# EAGLE design optic PCB (EAGLE 9.1.3)
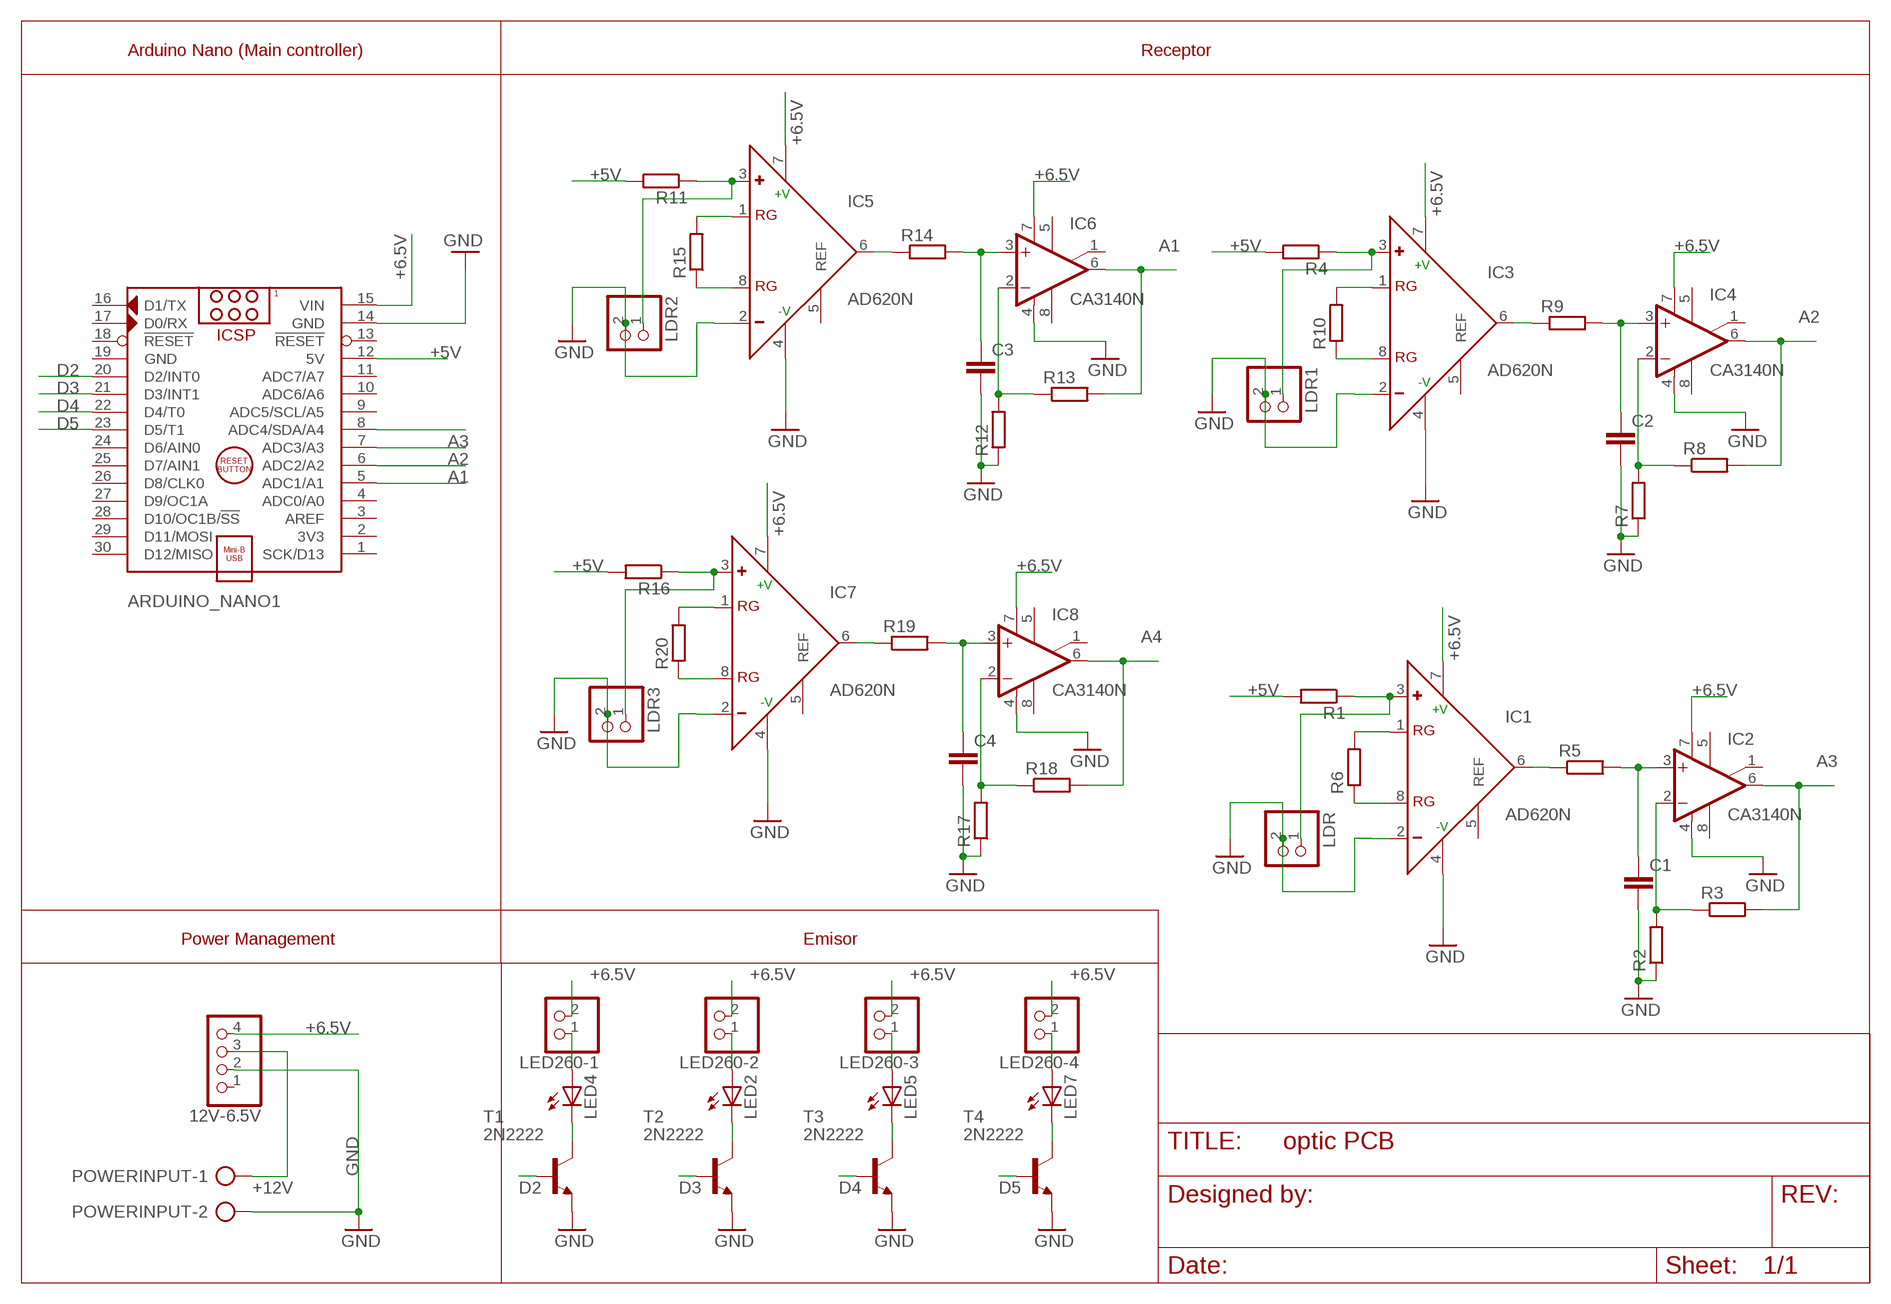
[diagram p0: schematic, sheet 1]

## Parts
12V-6.5V  PINHD-1X4  [1X04]
ARDUINO_NANO1  ARDUINO_NANO  [ARDUINO_NANO]
C1  C2.5/2  [C2.5-2]
C2  C2.5/2  [C2.5-2]
C3  C2.5/2  [C2.5-2]
C4  C2.5/2  [C2.5-2]
IC1  AD620N  [DIL08]
IC2  CA3140N  [DIL08]
IC3  AD620N  [DIL08]
IC4  CA3140N  [DIL08]
IC5  AD620N  [DIL08]
IC6  CA3140N  [DIL08]
IC7  AD620N  [DIL08]
IC8  CA3140N  [DIL08]
LDR  PINHD-1X2  [1X02]
LDR1  PINHD-1X2  [1X02]
LDR2  PINHD-1X2  [1X02]
LDR3  PINHD-1X2  [1X02]
LED2  LED5MM  [LED5MM]
LED4  LED5MM  [LED5MM]
LED5  LED5MM  [LED5MM]
LED7  LED5MM  [LED5MM]
LED260-1  PINHD-1X2  [1X02]
LED260-2  PINHD-1X2  [1X02]
LED260-3  PINHD-1X2  [1X02]
LED260-4  PINHD-1X2  [1X02]
POWERINPUT  AK500/2  [AK500/2]
R1  R-EU_0204/5  [0204/5]
R2  R-EU_0204/5  [0204/5]
R3  R-EU_0204/5  [0204/5]
R4  R-EU_0204/5  [0204/5]
R5  R-EU_0204/5  [0204/5]
R6  R-EU_0204/5  [0204/5]
R7  R-EU_0204/5  [0204/5]
R8  R-EU_0204/5  [0204/5]
R9  R-EU_0204/5  [0204/5]
R10  R-EU_0204/5  [0204/5]
R11  R-EU_0204/5  [0204/5]
R12  R-EU_0204/5  [0204/5]
R13  R-EU_0204/5  [0204/5]
R14  R-EU_0204/5  [0204/5]
R15  R-EU_0204/5  [0204/5]
R16  R-EU_0204/5  [0204/5]
R17  R-EU_0204/5  [0204/5]
R18  R-EU_0204/5  [0204/5]
R19  R-EU_0204/5  [0204/5]
R20  R-EU_0204/5  [0204/5]
T1  2N2222  [TO18]
T2  2N2222  [TO18]
T3  2N2222  [TO18]
T4  2N2222  [TO18]

## Nets
+5V: ARDUINO_NANO1.12(5V) R1.2 R4.2 R11.2 R16.2
+6.5V: 12V-6.5V.4 ARDUINO_NANO1.15(VIN) IC1.7(+V) IC2.7(V+) IC3.7(+V) IC4.7(V+) IC5.7(+V) IC6.7(V+) IC7.7(+V) IC8.7(V+) LED260-1.2 LED260-2.2 LED260-3.2 LED260-4.2
+12V: 12V-6.5V.3 POWERINPUT.1
A1: ARDUINO_NANO1.5(ADC1/A1) IC6.6(OUT) R13.2
A2: ARDUINO_NANO1.6(ADC2/A2) IC4.6(OUT) R8.2
A3: ARDUINO_NANO1.7(ADC3/A3) IC2.6(OUT) R3.2
A4: ARDUINO_NANO1.8(ADC4/SDA/A4) IC8.6(OUT) R18.2
D2: ARDUINO_NANO1.20(D2/INT0) T1.2(B)
D3: ARDUINO_NANO1.21(D3/INT1) T2.2(B)
D4: ARDUINO_NANO1.22(D4/T0) T3.2(B)
D5: ARDUINO_NANO1.23(D5/T1) T4.2(B)
GND: 12V-6.5V.2 ARDUINO_NANO1.14(GND) C1.2 C2.2 C3.2 C4.2 IC1.2(-) IC1.4(-V) IC2.4(V-) IC3.2(-) IC3.4(-V) IC4.4(V-) IC5.2(-) IC5.4(-V) IC6.4(V-) IC7.2(-) IC7.4(-V) IC8.4(V-) LDR1.2 LDR2.2 LDR3.2 LDR.2 POWERINPUT.2 R2.1 R7.1 R12.1 R17.1 T1.1(E) T2.1(E) T3.1(E) T4.1(E)
N$1: IC3.1(RG) R10.2
N$2: IC1.1(RG) R6.2
N$3: IC1.8(RG) R6.1
N$4: IC3.8(RG) R10.1
N$5: IC1.6(OUT) R5.1
N$6: C1.1 IC2.3(+IN) R5.2
N$7: IC2.2(-IN) R2.2 R3.1
N$8: LED4.K(C) T1.3(C)
N$9: IC1.3(+) LDR.1 R1.1
N$10: IC3.6(OUT) R9.1
N$11: C2.1 IC4.3(+IN) R9.2
N$12: IC4.2(-IN) R7.2 R8.1
N$13: IC3.3(+) LDR1.1 R4.1
N$14: IC5.1(RG) R15.2
N$15: IC5.8(RG) R15.1
N$16: IC5.6(OUT) R14.1
N$17: C3.1 IC6.3(+IN) R14.2
N$18: IC6.2(-IN) R12.2 R13.1
N$19: IC5.3(+) LDR2.1 R11.1
N$20: IC7.1(RG) R20.2
N$21: IC7.8(RG) R20.1
N$22: IC7.6(OUT) R19.1
N$23: C4.1 IC8.3(+IN) R19.2
N$24: IC8.2(-IN) R17.2 R18.1
N$25: IC7.3(+) LDR3.1 R16.1
N$26: LED4.A LED260-1.1
N$27: LED2.K(C) T2.3(C)
N$28: LED2.A LED260-2.1
N$29: LED5.K(C) T3.3(C)
N$30: LED5.A LED260-3.1
N$31: LED7.K(C) T4.3(C)
N$32: LED7.A LED260-4.1
Unconnected: 12V-6.5V.1 ARDUINO_NANO1.1(SCK/D13) ARDUINO_NANO1.2(3V3) ARDUINO_NANO1.3(AREF) ARDUINO_NANO1.4(ADC0/A0) ARDUINO_NANO1.9(ADC5/SCL/A5) ARDUINO_NANO1.10(ADC6/A6) ARDUINO_NANO1.11(ADC7/A7) ARDUINO_NANO1.13(!RESET) ARDUINO_NANO1.16(D1/TX) ARDUINO_NANO1.17(D0/RX) ARDUINO_NANO1.18(!RESET) ARDUINO_NANO1.24(D6/AIN0) ARDUINO_NANO1.25(D7/AIN1) ARDUINO_NANO1.26(D8/CLK0) ARDUINO_NANO1.27(D9/OC1A) ARDUINO_NANO1.28(D10/OC1B/!SS) ARDUINO_NANO1.29(D11/MOSI) ARDUINO_NANO1.30(D12/MISO) IC1.5(REF) IC2.1(ON/CMP) IC2.5(ON) IC2.8(CMP) IC3.5(REF) IC4.1(ON/CMP) IC4.5(ON) IC4.8(CMP) IC5.5(REF) IC6.1(ON/CMP) IC6.5(ON) IC6.8(CMP) IC7.5(REF) IC8.1(ON/CMP) IC8.5(ON) IC8.8(CMP)

## Notes on the sheet
- Arduino Nano (Main controller) | Receptor
- Power Management | Emisor

## Power pins joined to a net without a drawn wire
GND: ARDUINO_NANO1.19(GND)

## Library data of the parts
12V-6.5V = pinhead:PINHD-1X4: PIN HEADER; SPICEPREFIX: E
ARDUINO_NANO1 = ArduinoNanoV30:ARDUINO_NANO: Arduino Nano V3.0 Module Overview: The Arduino Nano is a small, complete, and breadboard-friendly board based on the ATmega328 (Arduino Nano 3.x) or ATmega168 (Arduino Nano 2.x). It has more or less the same functionality of the Arduino Duemilanove, but in a different package. It lacks only a DC power jack, and works with a Mini-B USB cable instead of a standard one. The Nano was designed and is being produced by Gravitech <http://www.gravitech.us/arna30wiatp.html>. General specifications: Item Value Microcontroller Atmel ATmega168 or ATmega328 Operating Voltage (logic level) 5 V Input Voltage (recommended) 7-12 V Input Voltage (limits) 6-20 V Digital I/O Pins 14 (of which 6 provide PWM output) Analog Input Pins 8 DC Current per I/O Pin 40 mA Flash Memory 16 KB (ATmega168) or 32 KB (ATmega328) of which 2 KB used by bootloader SRAM 1 KB (ATmega168) or 2 KB (ATmega328) EEPROM 512 bytes (ATmega168) or 1 KB (ATmega328) Clock Speed 16 MHz Dimensions (Inches) 0.73" x 1.70" Dimensions (mm) 18mm x 45mm Overall height About 9 mm (not including pins) Weigth 5 g Power: The Arduino Nano can be powered via the Mini-B USB connection, 6-20V unregulated external power supply (pin 30), or 5V regulated external power supply (pin 27). The power source is automatically selected to the highest voltage source. Memory: The ATmega168 has 16 KB of flash memory for storing code (of which 2 KB is used for the bootloader); the ATmega328 has 32 KB, (also with 2 KB used for the bootloader). The ATmega168 has 1 KB of SRAM and 512 bytes of EEPROM (which can be read and written with the EEPROM library); the ATmega328 has 2 KB of SRAM and 1 KB of EEPROM. Input and Output: Each of the 14 digital pins on the Nano can be used as an input or output, using pinMode(), digitalWrite(), and digitalRead() functions. They operate at 5 volts. Each pin can provide or receive a maximum of 40 mA and has an internal pull-up resistor (disconnected by default) of 20-50 kOhms. In addition, some pins have specialized functions. Visit Arduino - ArduinoBoardNano <https://www.arduino.cc/en/Main/ArduinoBoardNano>
C1-C4 = capacitor-wima:C: CAPACITOR naming: grid - package width
IC1 IC3 IC5 IC7 = analog-devices:AD620: Low Cost, Low Power, Instrumentation Amplifier Source: http://www.analog.com/UploadedFiles/Data_Sheets/37793330023930AD620_e.pdf; MF: ALTERA CORPORATION; MPN: AD620AN; OC_FARNELL: 1523782; OC_NEWARK: 05F7108
IC2 IC4 IC6 IC8 = linear:CA3140: OP AMP
LDR LDR1-LDR3 LED260-1-LED260-4 = pinhead:PINHD-1X2: PIN HEADER
LED2 LED4 LED5 LED7 = SparkFun:LED: LEDs Standard schematic elements and footprints for 5mm, 3mm, 1206, and 0603 sized LEDs. 5mm - Spark Fun Electronics SKU : COM-00529 (and others)
POWERINPUT = con-ptr500:AK500/2: CONNECTOR; OC_FARNELL: unknown; OC_NEWARK: unknown
R1-R20 = resistor:R-EU_: RESISTOR, European symbol
T1-T4 = transistor:2N2222: NPN TRANSISTOR

## Board
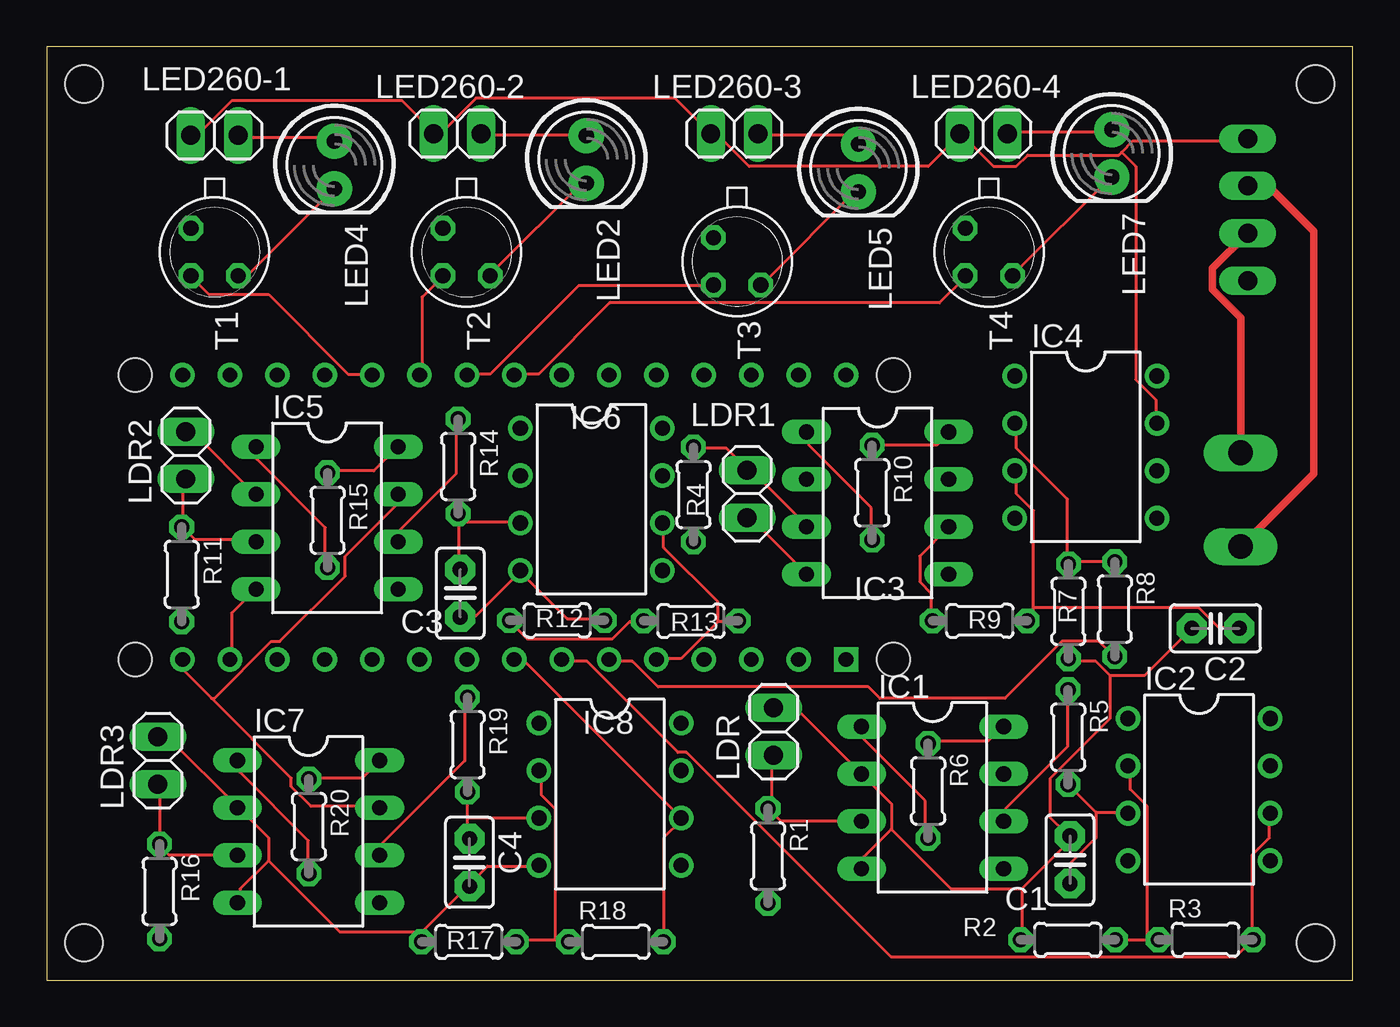
[diagram p1: board, top side]
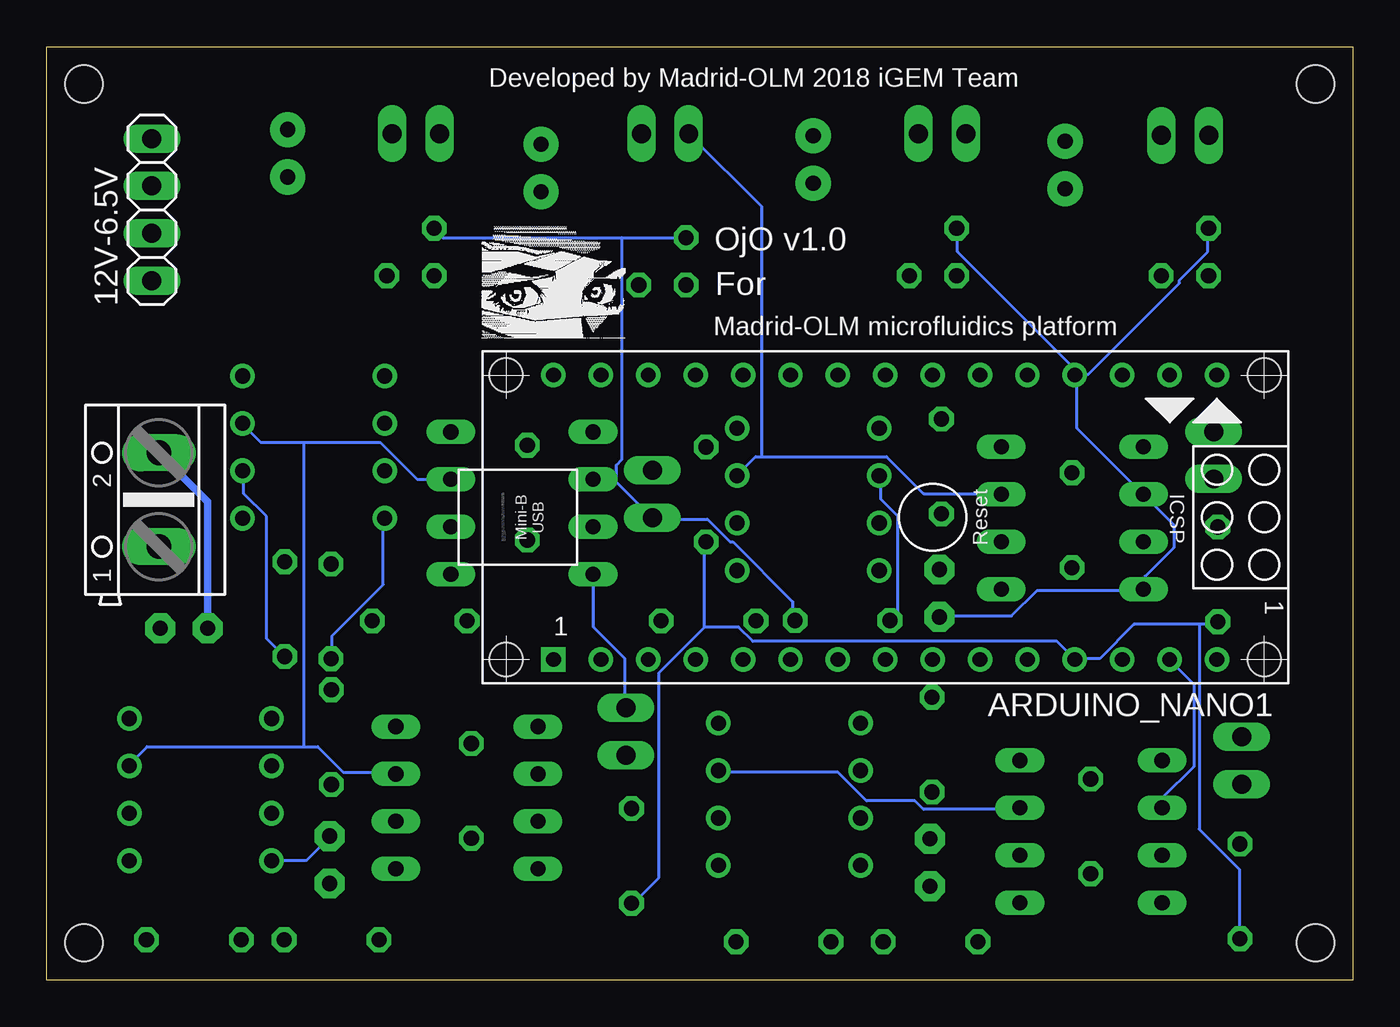
[diagram p2: board, bottom side, seen from below]

Size 70 x 50 mm. Coordinates in mm from the lower left corner, seen from the top.
Outline: 0,0 70,0 70,50 0,50 0,0
Copper layers (1*16): Top 0.035mm / dielectric 1.5mm / Bottom 0.035mm
Design rules "default": minimum track width 6mil, minimum drill 0.35mm, track to track 6mil, track to pad 6mil, pad to pad 6mil, via to via 6mil, smd to smd 6mil, copper to edge 40mil, drill to drill 6mil, minimum pad ring 10mil, minimum via ring 8mil, stop-mask expansion 4mil, vias tented up to drill 0mil, thermal gap 10mil
Holes 2 mm at 2,48 68,48 68,2 2,2

### Footprints (pad centres in the part's own frame; a part is rotated, then mirrored left to right if it is on the bottom)
1X04 = drill 1.016 long: 1 -3.81,0; 2 -1.27,0; 3 1.27,0; 4 3.81,0
ARDUINO_NANO = drill 0.8 square: 1 -20.32,-7.62 | drill 0.8: 2 -17.78,-7.62; 3 -15.24,-7.62; 4 -12.7,-7.62; 5 -10.16,-7.62; 6 -7.62,-7.62; 7 -5.08,-7.62; 8 -2.54,-7.62; 9 0,-7.62; 10 2.54,-7.62; 11 5.08,-7.62; 12 7.62,-7.62; 13 10.16,-7.62; 14 12.7,-7.62; 15 15.24,-7.62; 16 15.24,7.62; 17 12.7,7.62; 18 10.16,7.62; 19 7.62,7.62; 20 5.08,7.62; 21 2.54,7.62; 22 0,7.62; 23 -2.54,7.62; 24 -5.08,7.62; 25 -7.62,7.62; 26 -10.16,7.62; 27 -12.7,7.62; 28 -15.24,7.62; 29 -17.78,7.62; 30 -20.32,7.62 | hole 1.778: -22.86,-7.62; -22.86,7.62; 17.78,7.62; 17.78,-7.62
C2.5-2 = drill 0.813 pad 1.6 octagon: 1 -1.27,0; 2 1.27,0
DIL08 = drill 0.813 long: 1 -3.81,-3.81; 2 -1.27,-3.81; 3 1.27,-3.81; 4 3.81,-3.81; 5 3.81,3.81; 6 1.27,3.81; 7 -1.27,3.81; 8 -3.81,3.81
DIL08' = drill 0.813 pad 1.27: 1 -3.81,-3.81; 2 -1.27,-3.81; 3 1.27,-3.81; 4 3.81,-3.81; 5 3.81,3.81; 6 1.27,3.81; 7 -1.27,3.81; 8 -3.81,3.81
1X02 = drill 1.016 long: 1 -1.27,0; 2 1.27,0
LED5MM = drill 0.813 pad 1.88: A -1.27,0; K 1.27,0
AK500/2 = drill 1.321 long: 1 -2.515,0; 2 2.515,0
0204/5 = drill 0.813 octagon: 1 -2.54,0; 2 2.54,0
TO18 = drill 0.813 octagon: 1 -1.27,-1.27; 2 1.27,-1.27; 3 1.27,1.27

### Placement (x,y rotation side)
12V-6.5V  64.36,41.27 90 bottom
ARDUINO_NANO1  22.52,24.79 0 bottom
C1  54.84,6.44 90 top
C2  62.64,18.84 180 top
C3  22.16,20.72 270 top
C4  22.66,6.3 270 top
IC1  47.48,9.77 270 top
IC2  CA3140N  [DIL08']  61.76,10.2 270 top
IC3  44.53,25.55 270 top
IC4  CA3140N  [DIL08']  55.69,28.55 270 top
IC5  15.03,24.75 270 top
IC6  CA3140N  [DIL08']  29.19,25.75 270 top
IC7  14.03,7.95 270 top
IC8  CA3140N  [DIL08']  30.19,9.95 270 top
LDR  38.96,13.31 90 top
LDR1  37.54,26.04 270 top
LDR2  7.46,28.11 90 top
LDR3  5.96,11.76 90 top
LED2  28.92,43.96 270 top
LED4  15.42,43.66 270 top
LED5  43.5,43.5 270 top
LED7  57.08,44.29 270 top
LED260-1  9,45.25 180 top
LED260-2  22.01,45.34 180 top
LED260-3  36.86,45.34 180 top
LED260-4  50.21,45.34 180 top
POWERINPUT  63.99,25.73 90 bottom
R1  38.66,6.65 270 top
R2  54.73,2.16 0 top
R3  62.11,2.16 0 top
R4  34.66,26.01 270 top
R5  54.74,13.01 270 top
R6  47.24,10.13 270 top
R7  54.76,19.75 90 top
R8  57.24,19.87 270 top
R9  50.01,19.24 0 top
R10  44.24,26.11 270 top
R11  7.24,21.73 270 top
R12  27.35,19.26 180 top
R13  34.53,19.24 0 top
R14  22.05,27.51 270 top
R15  15.05,24.63 270 top
R16  6.05,4.75 270 top
R17  22.63,2.05 0 top
R18  30.51,2.05 0 top
R19  22.55,12.61 270 top
R20  14.05,8.23 270 top
T1  9,39 270 top
T2  22.5,39 270 top
T3  37,38.5 270 top
T4  50.5,39 270 top

### Tracks (layer width: path | path; a pad name or v marks a point on that pad's centre or on a via)
+5V
  Bottom 0.152: 34.75,18.9 34.75,23.47 R4.2 | 34.75,18.9 37.19,16.46 37.19,5.49 38.56,4.12 R1.2 | 8.23,19.05 7.32,19.05 R11.2 | 8.23,19.05 11.73,19.05 13.56,17.22 14.78,17.22 ARDUINO_NANO1.12 14.94,17.22 15.85,18.14 32.16,18.14 32.92,18.9 34.75,18.9 | 8.23,19.05 8.23,8.08 6.1,5.94 6.1,2.29 R16.2
+6.5V
  Top 0.152: 8.84,15.09 13.11,10.82 13.11,10.36 14.17,9.3 17.83,9.3 IC7.7 | 8.84,15.09 7.32,16.61 7.32,17.07 ARDUINO_NANO1.15 | 8.84,15.09 8.99,15.09 12.04,18.14 12.5,18.14 16,21.64 16,22.71 18.75,25.45 18.75,25.91 IC5.7 | LED260-1.2 7.77,45.26 8.08,45.26 9.91,47.09 19.05,47.09 20.73,45.41 LED260-2.2 20.88,45.41 21.18,45.41 23.01,47.24 33.68,47.24 35.51,45.41 LED260-3.2 35.66,45.26 35.97,45.26 37.64,43.59 47.24,43.59 48.92,45.26 LED260-4.2 49.07,45.26 50.75,43.59 51.97,43.59 52.58,44.2 57.45,44.2 57.61,44.35 | 57.61,44.35 58.22,44.96 64.31,44.96 12V-6.5V.4 | 57.61,44.35 58.37,43.59 58.37,32.16 59.44,31.09 59.44,29.87 IC4.7
  Bottom 0.152: 31.7,28.04 32,28.04 32.92,27.13 IC6.7 | 31.7,28.04 24.99,28.04 23.01,26.06 18.9,26.06 IC5.7 | IC8.7 33.98,11.12 27.58,11.12 26.06,9.6 23.47,9.6 23.01,9.14 17.98,9.14 IC7.7 | 56.24,12.5 64.62,12.5 65.53,11.58 IC2.7 | 56.24,12.5 55.47,12.5 54.1,11.12 51.36,11.12 IC1.7 | 56.24,28.8 58.52,28.8 59.44,29.72 IC4.7 | 56.24,28.8 52.12,28.8 50.14,26.82 48.46,26.82 IC3.7 | 56.24,28.8 56.24,12.5 | 31.7,28.04 31.7,41.45 35.51,45.26 LED260-3.2
+12V
  Top 0.152: 64.47,42.52 12V-6.5V.3
  Top 0.406: POWERINPUT.1 67.89,27.12 67.89,40.11 65.46,42.54 12V-6.5V.3
A1
  Top 0.152: 35.97,19.2 33.98,17.22 32.77,17.22 ARDUINO_NANO1.5 | 35.97,19.2 37.03,19.2 R13.2 | 35.97,19.2 35.97,20.27 33.07,23.16 33.07,24.38 IC6.6
A2
  Top 0.152: ARDUINO_NANO1.6 30.18,17.07 31.39,17.07 32.77,15.7 44.04,15.7 44.65,15.09 51.36,15.09 54.41,18.14 56.39,18.14 57.15,17.37 R8.2
  Bottom 0.152: IC4.6 59.44,27.28 59.44,26.06 58.22,24.84 58.22,18.29 57.3,17.37 R8.2
A3
  Top 0.152: ARDUINO_NANO1.7 27.74,17.07 28.96,17.07 33.83,12.19 34.29,12.19 45.26,1.22 63.7,1.22 64.62,2.13 R3.2 64.62,2.29 64.62,6.71 65.53,7.62 65.53,8.84 IC2.6
A4
  Top 0.152: ARDUINO_NANO1.8 25.15,17.07 25.6,17.07 33.98,8.69 IC8.6 33.98,8.53 33.07,7.62 33.07,2.13 R18.2
D2
  Top 0.152: ARDUINO_NANO1.20 17.37,32.46 16.15,32.46 11.89,36.73 8.69,36.73 7.77,37.64 T1.2
D3
  Top 0.152: ARDUINO_NANO1.21 20.12,32.46 20.12,36.58 21.18,37.64 T2.2
D4
  Top 0.152: ARDUINO_NANO1.22 22.55,32.46 23.77,32.46 28.5,37.19 35.66,37.19 T3.2
D5
  Top 0.152: ARDUINO_NANO1.23 25.15,32.46 26.36,32.46 30.18,36.27 47.85,36.27 49.23,37.64 T4.2
GND
  Top 0.152: 20.12,2.59 20.12,2.13 R17.1 20.12,2.59 | 20.12,2.59 22.55,5.03 C4.2 22.71,5.18 23.62,6.1 26.36,6.1 IC8.4 | 11.89,6.4 10.36,4.88 10.36,4.27 IC7.4 | 11.89,6.4 11.89,7.62 10.36,9.14 IC7.2 10.21,9.3 6.55,12.95 6.1,12.95 LDR3.2 | 20.12,2.59 15.7,2.59 11.89,6.4 | ARDUINO_NANO1.14 9.91,17.22 9.91,19.66 11.12,20.88 IC5.4 | LDR2.2 7.47,29.26 7.92,29.26 11.12,26.06 IC5.2 | 57,16.31 56.24,17.07 54.86,17.07 R7.1 | 57,16.31 58.83,16.31 61.27,18.75 C2.2 | 52.27,4.88 52.27,2.29 R2.1 | 52.27,4.88 54.71,7.32 54.71,7.62 C1.2 54.71,7.77 53.8,8.69 53.8,10.82 57,14.02 57,16.31 | R12.1 29.87,19.36 27.89,19.36 25.45,21.79 IC6.4 25.3,21.79 23.01,19.51 22.25,19.51 C3.2 | IC3.4 40.69,21.79 37.64,24.84 LDR1.2 | 45.26,8.08 43.74,6.55 43.74,6.1 IC1.4 | 45.26,8.08 45.26,9.45 43.74,10.97 IC1.2 43.59,11.12 40.23,14.48 39.01,14.48 LDR.2 | 52.27,4.88 48.46,4.88 45.26,8.08
  Top 0.406: POWERINPUT.2 63.99,35.49 62.48,36.99 62.48,38.12 12V-6.5V.2
  Bottom 0.152: ARDUINO_NANO1.19 14.78,32.31 14.78,29.57 11.28,26.06 IC5.2 11.12,25.91 9.6,24.38 9.6,23.16 11.12,21.64 11.12,21.03 IC5.4 11.28,20.88 16.92,20.88 18.29,19.51 22.1,19.51 C3.2 | 14.63,32.46 14.78,32.46 ARDUINO_NANO1.19 | 14.63,32.46 14.17,32.46 9.3,37.34 9.3,37.49 7.77,39.01 7.77,40.23 T1.1 | 14.63,32.46 21.18,39.01 21.18,40.23 T2.1 | 14.63,32.46 ARDUINO_NANO1.19 | IC7.2 10.21,9.3 10.21,9.75 8.53,11.43 8.53,15.85 9.75,17.07 ARDUINO_NANO1.14 | IC4.4 51.97,24.69 51.97,21.18 54.71,18.44 54.71,17.22 R7.1 | 61.42,18.9 C2.2 | 39.17,39.78 48.77,39.78 49.23,40.23 T4.1 | 39.17,39.78 35.81,39.78 T3.1 | IC2.4 57.91,6.4 56.08,6.4 54.86,7.62 C1.2 | 39.47,26.67 40.69,26.67 IC3.2 39.47,26.67 | 39.47,26.67 37.64,24.84 LDR1.2 37.49,24.69 34.59,24.69 33.38,23.47 33.22,23.47 30.02,20.27 30.02,19.36 R12.1 | IC3.4 40.69,21.64 40.69,18.9 39.01,17.22 39.01,14.63 LDR.2 | 39.17,39.78 39.17,27.89 39.47,27.58 39.47,26.67
  Bottom 0.406: POWERINPUT.2 61.37,25.62 C2.2
N$1
  Top 0.152: IC3.1 40.84,29.26 40.84,28.65 44.2,25.3 44.2,23.62 R10.2
N$2
  Top 0.152: IC1.1 43.74,13.56 43.74,12.95 47.09,9.6 47.09,7.62 R6.2
N$3
  Top 0.152: R6.1 47.24,12.8 50.44,12.8 51.21,13.56 IC1.8
N$4
  Top 0.152: R10.1 44.35,28.65 47.7,28.65 48.31,29.26 IC3.8
N$5
  Top 0.152: IC1.6 51.36,8.53 51.36,9.14 54.71,12.5 54.71,15.54 R5.1
N$6
  Top 0.152: 56.24,8.99 57.91,8.99 IC2.3 | 56.24,8.99 54.86,10.36 R5.2 | 56.24,8.99 56.24,7.62 54.86,6.25 54.86,5.18 C1.1
N$7
  Top 0.152: 58.98,2.13 59.44,2.13 R3.1 58.98,2.13 | 58.98,2.13 57.3,2.13 R2.2 | 58.98,2.13 58.98,9.3 58.06,10.21 58.06,11.43 IC2.2
N$8
  Top 0.152: T1.3 10.36,37.8 10.82,37.8 15.39,42.37 LED4.K
N$9
  Top 0.152: IC1.3 43.59,8.53 39.32,8.53 38.71,9.14 R1.1 38.71,9.3 38.86,9.45 38.86,12.04 LDR.1
N$10
  Top 0.152: R9.1 47.4,19.36 47.4,20.73 46.79,21.34 46.79,22.71 48.31,24.23 IC3.6
N$11
  Top 0.152: 52.88,19.96 52.88,19.66 52.58,19.36 R9.2 | 52.88,19.96 52.88,25.15 51.97,26.06 51.97,27.28 IC4.3 | 52.88,19.96 61.72,19.96 62.79,18.9 63.86,18.9 C2.1
N$12
  Top 0.152: R8.1 57.15,22.4 54.86,22.4 R7.2 54.71,22.4 54.71,25.76 51.97,28.5 51.97,29.72 IC4.2
N$13
  Top 0.152: R4.1 34.75,28.5 36.42,28.5 37.49,27.43 LDR1.1 37.64,27.43 40.69,24.38 IC3.3
N$14
  Top 0.152: IC5.1 11.28,28.5 11.28,27.89 14.94,24.23 14.94,22.1 R15.2
N$15
  Top 0.152: R15.1 15.09,27.28 17.53,27.28 18.75,28.5 IC5.8
N$16
  Top 0.152: IC5.6 18.9,23.62 18.9,24.08 21.95,27.13 21.95,30.02 R14.1
N$17
  Top 0.152: 22.1,24.54 22.1,22.1 C3.1 | 22.1,24.54 22.1,24.84 R14.2 22.1,24.54 | 22.1,24.54 25.3,24.54 IC6.3
N$18
  Top 0.152: R13.1 31.85,19.2 31.24,19.2 30.33,18.29 25.76,18.29 24.84,19.2 R12.2
  Bottom 0.152: IC6.2 25.3,26.98 25.3,25.76 24.38,24.84 24.38,19.66 24.69,19.36 R12.2
N$19
  Top 0.152: IC5.3 11.12,23.62 7.92,23.62 7.32,24.23 R11.1 7.32,24.38 7.32,26.82 LDR2.1
N$20
  Top 0.152: IC7.1 10.36,11.73 10.36,11.12 14.02,7.47 14.02,5.79 R20.2
N$21
  Top 0.152: R20.1 14.17,10.82 16.92,10.82 17.83,11.73 IC7.8
N$22
  Top 0.152: IC7.6 17.98,6.71 17.98,7.32 22.4,11.73 22.4,15.09 R19.1
N$23
  Top 0.152: 22.55,8.69 22.55,7.62 C4.1 | 22.55,8.69 22.55,10.06 R19.2 | 22.55,8.69 26.36,8.69 IC8.3
N$24
  Top 0.152: 27.28,2.13 27.89,2.13 R18.1 | 27.28,2.13 25.3,2.13 R17.2 | 27.28,2.13 27.28,9.14 26.52,9.91 26.52,11.12 IC8.2
N$25
  Top 0.152: IC7.3 10.21,6.71 6.55,6.71 6.1,7.16 R16.1 6.1,7.32 6.1,10.36 LDR3.1
N$26
  Top 0.152: LED260-1.1 10.36,45.11 15.24,45.11 15.39,44.96 LED4.A
N$27
  Top 0.152: T2.3 23.77,37.8 28.8,42.82 LED2.K
N$28
  Top 0.152: LED260-2.1 23.32,45.26 28.8,45.26 LED2.A
N$29
  Top 0.152: T3.3 38.41,37.34 43.43,42.37 LED5.K
N$30
  Top 0.152: LED260-3.1 38.25,45.26 42.98,45.26 43.43,44.81 LED5.A
N$31
  Top 0.152: T4.3 51.82,37.8 57,42.98 LED7.K
N$32
  Top 0.152: LED260-4.1 51.51,45.41 57,45.41 LED7.A

### Text on the board
bNames: Developed by Madrid-OLM 2018 iGEM Team | OjO v1.0 | For | Madrid-OLM microfluidics platform